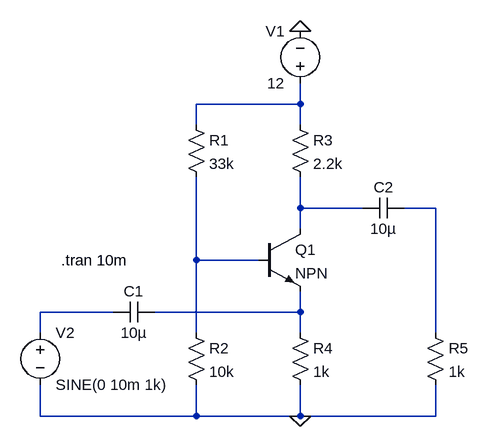
[diagram p0: schematic 4-cb.asc]
4-cb.asc, the LTspice schematic file:
Version 4.1
SHEET 1 880 680
WIRE 288 -80 288 -112
WIRE 288 -80 128 -80
WIRE 128 -48 128 -80
WIRE 288 -48 288 -80
WIRE 288 80 288 32
WIRE 384 80 288 80
WIRE 496 80 448 80
WIRE 288 112 288 80
WIRE 128 160 128 32
WIRE 224 160 128 160
WIRE 0 240 -112 240
WIRE 288 240 288 208
WIRE 288 240 64 240
WIRE -112 272 -112 240
WIRE 128 272 128 160
WIRE 288 272 288 240
WIRE 496 272 496 80
WIRE -112 400 -112 352
WIRE 128 400 128 352
WIRE 128 400 -112 400
WIRE 288 400 288 352
WIRE 288 400 128 400
WIRE 496 400 496 352
WIRE 496 400 288 400
FLAG 288 -192 0
FLAG 288 400 0
SYMBOL npn 224 112 R0
SYMATTR InstName Q1
SYMBOL voltage 288 -96 R180
WINDOW 0 24 96 Left 2
WINDOW 3 24 16 Left 2
SYMATTR InstName V1
SYMATTR Value 12
SYMBOL res 112 -64 R0
SYMATTR InstName R1
SYMATTR Value 33k
SYMBOL res 112 256 R0
SYMATTR InstName R2
SYMATTR Value 10k
SYMBOL res 272 -64 R0
SYMATTR InstName R3
SYMATTR Value 2.2k
SYMBOL res 272 256 R0
SYMATTR InstName R4
SYMATTR Value 1k
SYMBOL res 480 256 R0
SYMATTR InstName R5
SYMATTR Value 1k
SYMBOL voltage -112 256 R0
WINDOW 123 0 0 Left 0
WINDOW 39 0 0 Left 0
SYMATTR InstName V2
SYMATTR Value SINE(0 10m 1k)
SYMBOL cap 64 224 R90
WINDOW 0 0 32 VBottom 2
WINDOW 3 32 32 VTop 2
SYMATTR InstName C1
SYMATTR Value 10µ
SYMBOL cap 448 64 R90
WINDOW 0 0 32 VBottom 2
WINDOW 3 32 32 VTop 2
SYMATTR InstName C2
SYMATTR Value 10µ
TEXT -80 160 Left 2 !.tran 10m

The netlist it stands for:
* 4-cb.asc
Q1 N002 N004 N006 0 NPN
V1 N001 0 12
R1 N001 N004 33k
R2 N004 0 10k
R3 N001 N002 2.2k
R4 N006 0 1k
R5 N003 0 1k
V2 N005 0 SINE(0 10m 1k)
C1 N006 N005 10µ
C2 N003 N002 10µ
.model NPN NPN
.model PNP PNP
.lib standard.bjt
.tran 10m
.backanno
.end